# EAGLE board EEG_64 (EAGLE 6.6.0), part 1 of 2
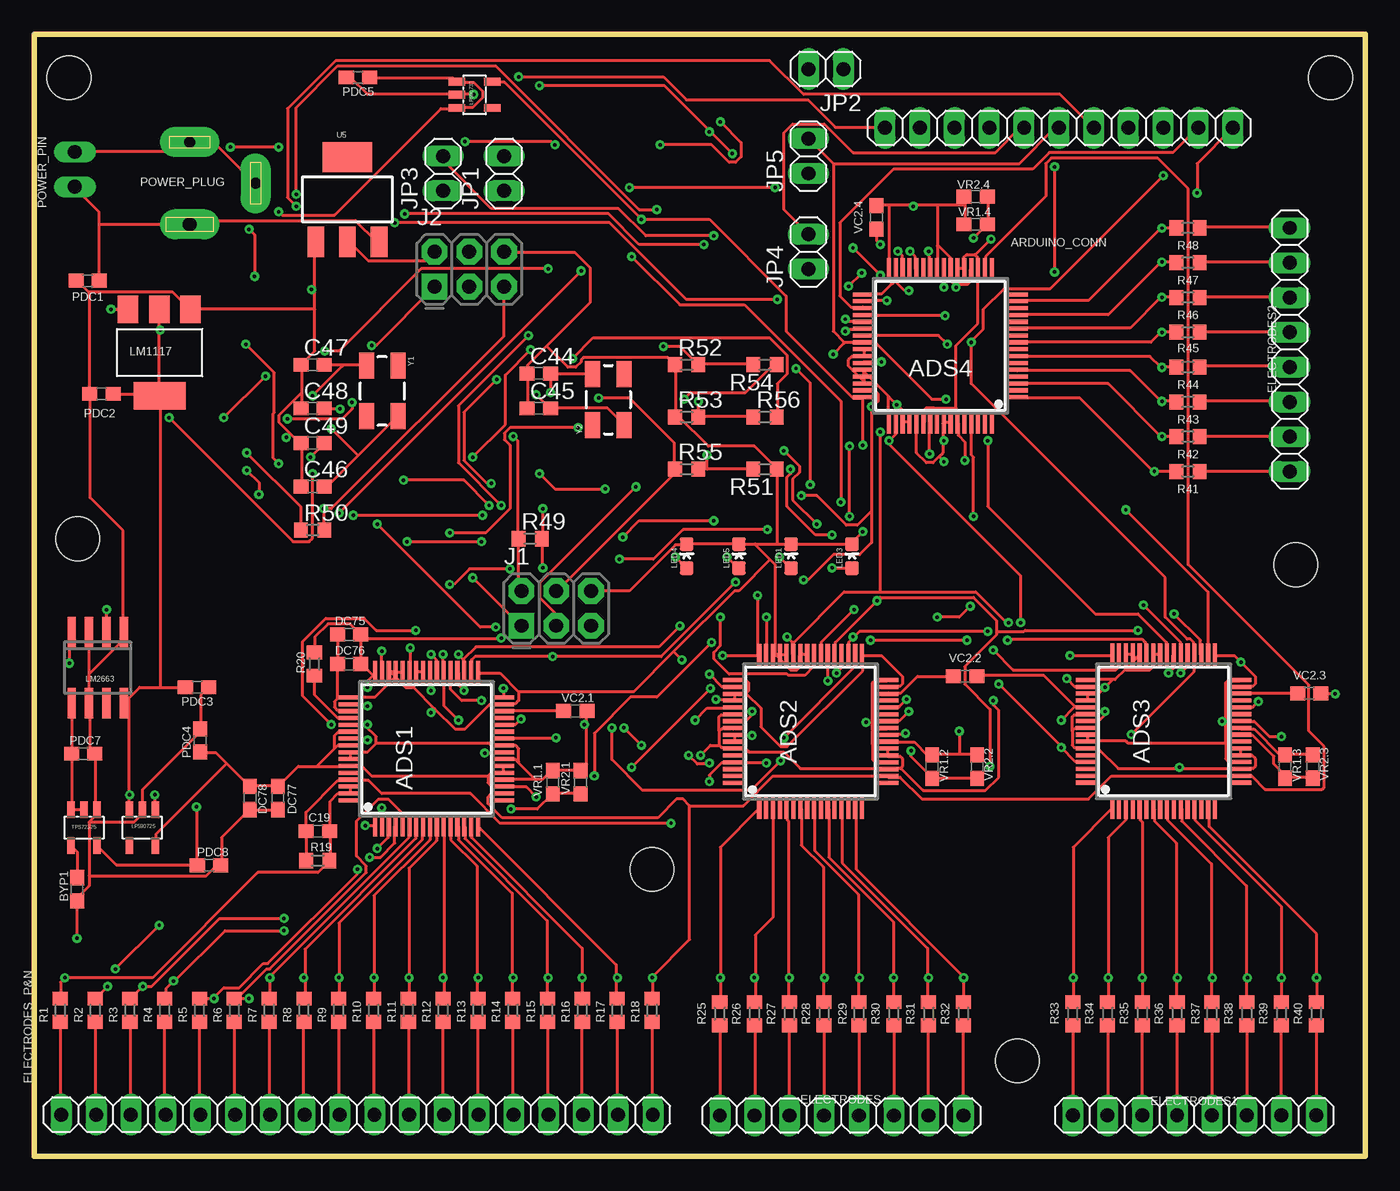
[diagram p3: board, top side]
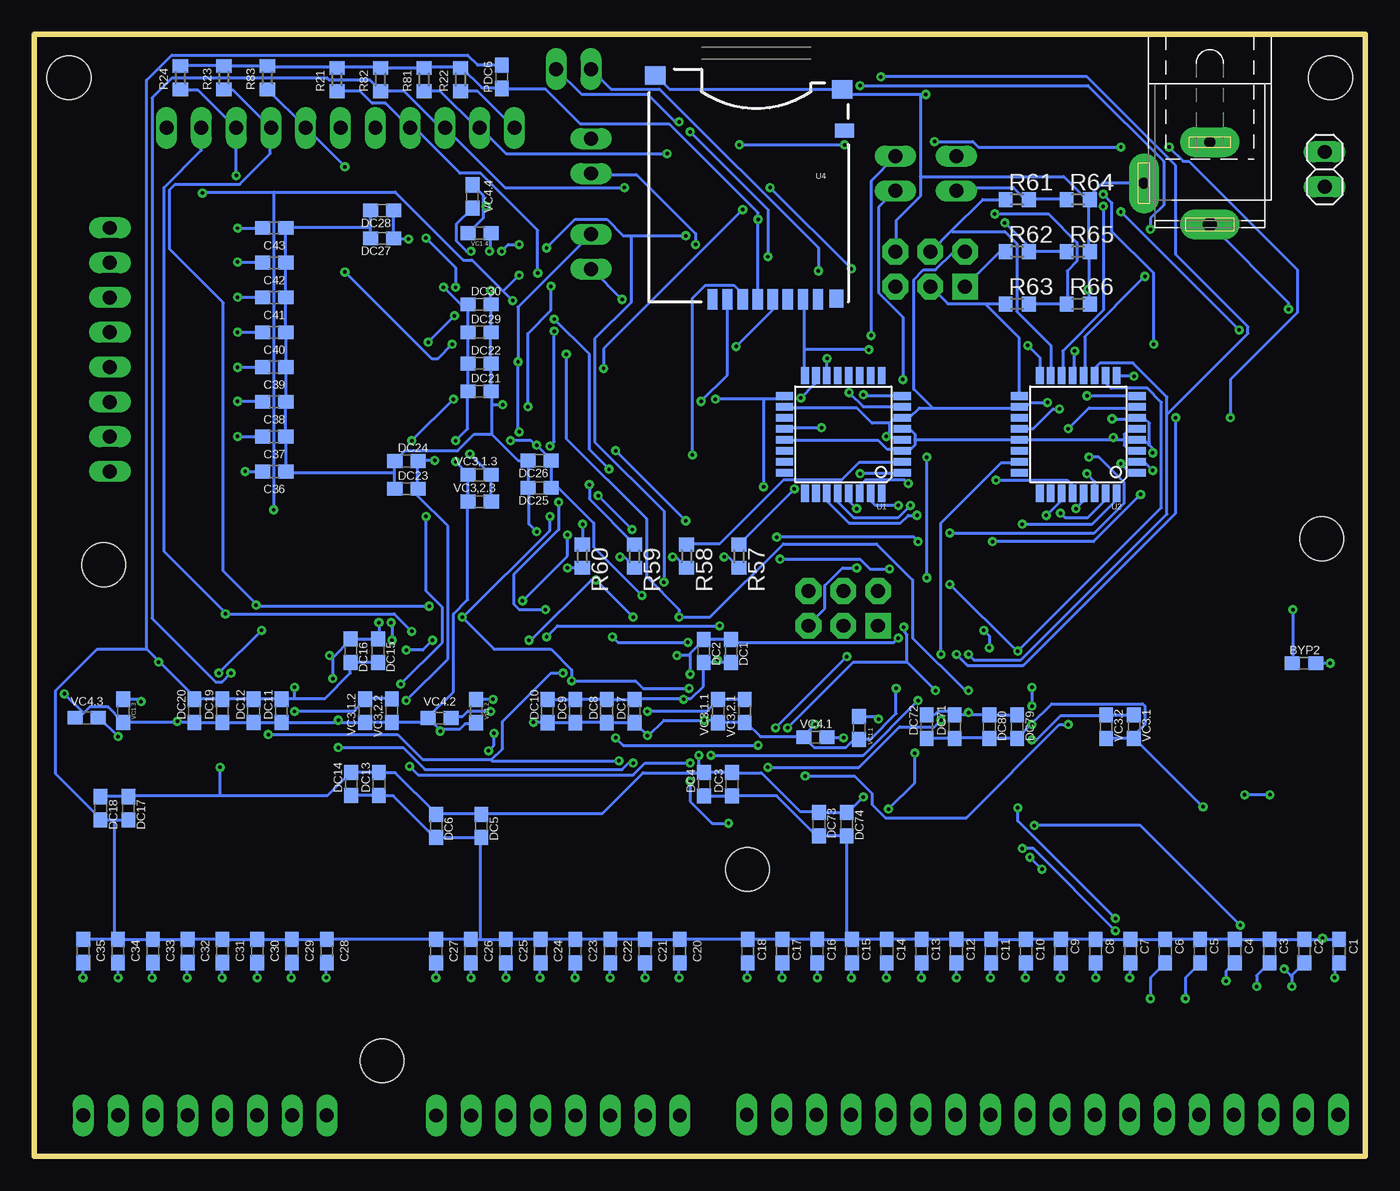
[diagram p4: board, bottom side, seen from below]

Size 97.16 x 81.92 mm. Coordinates in mm from the lower left corner, seen from the top.
Outline: 0,0 0,81.92 97.16,81.92 97.16,0 0,0
Copper layers (1*16): Top 0.035mm / dielectric 1.5mm / Bottom 0.035mm
Design rules "SparkFun *": minimum track width 8mil, minimum drill 10mil, track to track 6mil, track to pad 6mil, pad to pad 6mil, via to via 6mil, smd to smd 6mil, copper to edge 40mil, drill to drill 8mil, minimum pad ring 10mil, minimum via ring 8mil, stop-mask expansion 4mil, vias tented up to drill 30mil, thermal gap 10mil
Holes 3.2 mm at 2.54,78.74 94.61,78.74 71.75,6.99 45.09,20.95 3.17,45.09 92.08,43.18

## Footprints (pad centres in the part's own frame; a part is rotated, then mirrored left to right if it is on the bottom)
PAG_S-PQFP-G64 = smd 1.6 x 0.3: 1 -5.6,3.75; 2 -5.6,3.25; 3 -5.6,2.75; 4 -5.6,2.25; 5 -5.6,1.75; 6 -5.6,1.25; 7 -5.6,0.75; 8 -5.6,0.25; 9 -5.6,-0.25; 10 -5.6,-0.75; 11 -5.6,-1.25; 12 -5.6,-1.75; 13 -5.6,-2.25; 14 -5.6,-2.75; 15 -5.6,-3.25; 16 -5.6,-3.75; 33 5.6,-3.75; 34 5.6,-3.25; 35 5.6,-2.75; 36 5.6,-2.25; 37 5.6,-1.75; 38 5.6,-1.25; 39 5.6,-0.75; 40 5.6,-0.25; 41 5.6,0.25; 42 5.6,0.75; 43 5.6,1.25; 44 5.6,1.75; 45 5.6,2.25; 46 5.6,2.75; 47 5.6,3.25; 48 5.6,3.75 | smd 0.3 x 1.6: 17 -3.75,-5.6; 18 -3.25,-5.6; 19 -2.75,-5.6; 20 -2.25,-5.6; 21 -1.75,-5.6; 22 -1.25,-5.6; 23 -0.75,-5.6; 24 -0.25,-5.6; 25 0.25,-5.6; 26 0.75,-5.6; 27 1.25,-5.6; 28 1.75,-5.6; 29 2.25,-5.6; 30 2.75,-5.6; 31 3.25,-5.6; 32 3.75,-5.6; 49 3.75,5.6; 50 3.25,5.6; 51 2.75,5.6; 52 2.25,5.6; 53 1.75,5.6; 54 1.25,5.6; 55 0.75,5.6; 56 0.25,5.6; 57 -0.25,5.6; 58 -0.75,5.6; 59 -1.25,5.6; 60 -1.75,5.6; 61 -2.25,5.6; 62 -2.75,5.6; 63 -3.25,5.6; 64 -3.75,5.6
1X11 = drill 1.016 long: 1 -12.7,0; 2 -10.16,0; 3 -7.62,0; 4 -5.08,0; 5 -2.54,0; 6 0,0; 7 2.54,0; 8 5.08,0; 9 7.62,0; 10 10.16,0; 11 12.7,0
C0603 = smd 1.1 x 1: 1 -0.85,0; 2 0.85,0
1X08 = drill 1.016 long: 1 -8.89,0; 2 -6.35,0; 3 -3.81,0; 4 -1.27,0; 5 1.27,0; 6 3.81,0; 7 6.35,0; 8 8.89,0
1X18 = drill 1.016 long: 1 -21.59,0; 2 -19.05,0; 3 -16.51,0; 4 -13.97,0; 5 -11.43,0; 6 -8.89,0; 7 -6.35,0; 8 -3.81,0; 9 -1.27,0; 10 1.27,0; 11 3.81,0; 12 6.35,0; 13 8.89,0; 14 11.43,0; 15 13.97,0; 16 16.51,0; 17 19.05,0; 18 21.59,0
2X3-NS = drill 1.016 pad 1.88 square: 1 -2.54,-1.27 | drill 1.016 pad 1.88 octagon: 2 -2.54,1.27; 3 0,-1.27; 4 0,1.27; 5 2.54,-1.27; 6 2.54,1.27
1X02 = drill 1.016 long: 1 -1.27,0; 2 1.27,0
LED-0603 = smd 1 x 1: A 0,-0.877; C 0,0.877
SOT223 = smd 1.499 x 2.007: 1 -2.261,-3.15; 2 0.025,-3.15; 3 2.311,-3.15 | smd 3.81 x 2.007: 4 0,3.15
SO-08 = smd 0.6 x 2.2: 1 -1.905,-2.6; 2 -0.635,-2.6; 3 0.635,-2.6; 4 1.905,-2.6; 5 1.905,2.6; 6 0.635,2.6; 7 -0.635,2.6; 8 -1.905,2.6
SOT23-DBV = smd 0.55 x 1.2: 1 -0.95,-1.3; 2 0,-1.3; 3 0.95,-1.3; 4 0.95,1.3; 5 -0.95,1.3
SPC4077 = drill 0.8 pad 2.184 long: 1 -3,0; 2 0,-4.8 | drill 1 pad 2.184 long: 3 3,0
R0603 = smd 1 x 1.1: 1 -0.85,0; 2 0.85,0
TQFP32-08 = smd 1.27 x 0.559: 1 -4.293,2.8; 2 -4.293,2; 3 -4.293,1.2; 4 -4.293,0.4; 5 -4.293,-0.4; 6 -4.293,-1.2; 7 -4.293,-2; 8 -4.293,-2.8; 17 4.293,-2.8; 18 4.293,-2; 19 4.293,-1.2; 20 4.293,-0.4; 21 4.293,0.4; 22 4.293,1.2; 23 4.293,2; 24 4.293,2.8 | smd 0.559 x 1.27: 9 -2.8,-4.293; 10 -2,-4.293; 11 -1.2,-4.293; 12 -0.4,-4.293; 13 0.4,-4.293; 14 1.2,-4.293; 15 2,-4.293; 16 2.8,-4.293; 25 2.8,4.293; 26 2,4.293; 27 1.2,4.293; 28 0.4,4.293; 29 -0.4,4.293; 30 -1.2,4.293; 31 -2,4.293; 32 -2.8,4.293
USD-SOCKET-PP = smd 0.75 x 1.5: 1 3.2,16.8; 2 2.1,16.8; 3 1,16.8; 4 -0.1,16.8; 5 -1.2,16.8; 6 -2.3,16.8; 7 -3.4,16.8; 8 -4.5,16.8 | smd 1 x 1.3: CD1 -5.85,16.75 | smd 1.4 x 1: CD2 -6.425,4.5 | smd 1.5 x 1.35: GND1 -6.275,1.475; GND2 7.375,0.475
SOT223' = smd 1.219 x 2.235: 1 -2.311,-3.099; 2 0,-3.099; 3 2.311,-3.099 | smd 3.6 x 2.2: 4 0,3.099
CRYSTAL-SMD-5X3 = smd 1.9 x 1.1: 1 -1.85,-1.15; 2 1.85,-1.15; 3 1.85,1.15; 4 -1.85,1.15

## Placement (x,y rotation side)
ADS1  ADS1299  [PAG_S-PQFP-G64]  28.64,29.75 90 top
ADS2  ADS1299  [PAG_S-PQFP-G64]  56.67,31.02 90 top
ADS3  ADS1299  [PAG_S-PQFP-G64]  82.43,31.03 90 top
ADS4  ADS1299  [PAG_S-PQFP-G64]  66.14,59.17 180 top
ARDUINO_CONN  [1X11]  74.8,75.08 0 top
BYP1  0.01uF  [C0603]  3.13,19.5 90 top
BYP2  10uF  [C0603]  4.47,35.99 0 bottom
C1  4.7nF  [C0603]  1.91,14.99 270 bottom
C2  4.7nF  [C0603]  4.45,14.99 270 bottom
C3  4.7nF  [C0603]  6.99,14.99 270 bottom
C4  4.7nF  [C0603]  9.53,14.99 270 bottom
C5  4.7nF  [C0603]  12.06,14.99 270 bottom
C6  4.7nF  [C0603]  14.61,14.99 270 bottom
C7  4.7nF  [C0603]  17.14,14.99 270 bottom
C8  4.7nF  [C0603]  19.68,14.99 270 bottom
C9  4.7nF  [C0603]  22.23,14.99 270 bottom
C10  4.7nF  [C0603]  24.77,14.99 270 bottom
C11  4.7nF  [C0603]  27.3,14.99 270 bottom
C12  4.7nF  [C0603]  29.84,14.99 270 bottom
C13  4.7nF  [C0603]  32.38,14.99 270 bottom
C14  4.7nF  [C0603]  34.92,14.99 270 bottom
C15  4.7nF  [C0603]  37.47,14.99 270 bottom
C16  4.7nF  [C0603]  40.01,14.99 270 bottom
C17  4.7nF  [C0603]  42.55,14.99 270 bottom
C18  4.7nF  [C0603]  45.09,14.99 270 bottom
C19  1.5nF  [C0603]  20.7,23.75 180 top
C20  4.7nF  [C0603]  50.04,14.99 270 bottom
C21  4.7nF  [C0603]  52.58,14.99 270 bottom
C22  4.7nF  [C0603]  55.12,14.99 270 bottom
C23  4.7nF  [C0603]  57.66,14.99 270 bottom
C24  4.7nF  [C0603]  60.2,14.99 270 bottom
C25  4.7nF  [C0603]  62.74,14.99 270 bottom
C26  4.7nF  [C0603]  65.28,14.99 270 bottom
C27  4.7nF  [C0603]  67.82,14.99 270 bottom
C28  4.7nF  [C0603]  75.8,15 270 bottom
C29  4.7nF  [C0603]  78.34,15 270 bottom
C30  4.7nF  [C0603]  80.88,15 270 bottom
C31  4.7nF  [C0603]  83.42,15 270 bottom
C32  4.7nF  [C0603]  85.96,15 270 bottom
C33  4.7nF  [C0603]  88.5,15 270 bottom
C34  4.7nF  [C0603]  91.04,15 270 bottom
C35  4.7nF  [C0603]  93.58,15 270 bottom
C36  4.7nF  [C0603]  79.64,50 180 bottom
C37  4.7nF  [C0603]  79.64,52.54 180 bottom
C38  4.7nF  [C0603]  79.64,55.08 180 bottom
C39  4.7nF  [C0603]  79.64,57.62 180 bottom
C40  4.7nF  [C0603]  79.64,60.16 180 bottom
C41  4.7nF  [C0603]  79.64,62.7 180 bottom
C42  4.7nF  [C0603]  79.64,65.24 180 bottom
C43  4.7nF  [C0603]  79.64,67.78 180 bottom
C44  4.7nF  [C0603]  36.83,57.15 0 top
C45  4.7nF  [C0603]  36.83,54.61 0 top
C46  4.7nF  [C0603]  20.32,48.9 0 top
C47  4.7nF  [C0603]  20.32,57.78 0 top
C48  4.7nF  [C0603]  20.32,54.61 0 top
C49  4.7nF  [C0603]  20.32,52.07 0 top
DC1  1uF  [C0603]  46.3,36.89 270 bottom
DC2  0.1uF  [C0603]  48.3,36.89 270 bottom
DC3  1uF  [C0603]  46.23,27.18 270 bottom
DC4  0.1uF  [C0603]  48.26,27.18 270 bottom
DC5  1uF  [C0603]  64.52,24.13 270 bottom
DC6  0.1uF  [C0603]  67.82,24.13 270 bottom
DC7  1uF  [C0603]  53.34,32.51 90 bottom
DC8  0.1uF  [C0603]  55.37,32.51 90 bottom
DC9  1uF  [C0603]  57.66,32.51 90 bottom
DC10  0.1uF  [C0603]  59.69,32.51 90 bottom
DC11  1uF  [C0603]  79.1,32.52 90 bottom
DC12  0.1uF  [C0603]  81.14,32.52 90 bottom
DC13  1uF  [C0603]  71.99,27.19 270 bottom
DC14  0.1uF  [C0603]  74.02,27.19 270 bottom
DC15  1uF  [C0603]  72.06,36.91 270 bottom
DC16  0.1uF  [C0603]  74.06,36.91 270 bottom
DC17  1uF  [C0603]  90.28,25.41 270 bottom
DC18  0.1uF  [C0603]  92.31,25.41 270 bottom
DC19  1uF  [C0603]  83.42,32.52 90 bottom
DC20  0.1uF  [C0603]  85.45,32.52 90 bottom
DC21  1uF  [C0603]  64.65,55.84 0 bottom
DC22  0.1uF  [C0603]  64.65,57.87 0 bottom
DC23  1uF  [C0603]  69.98,48.73 180 bottom
DC24  0.1uF  [C0603]  69.98,50.76 180 bottom
DC25  1uF  [C0603]  60.27,48.8 180 bottom
DC26  0.1uF  [C0603]  60.27,50.8 180 bottom
DC27  1uF  [C0603]  71.76,67.02 180 bottom
DC28  0.1uF  [C0603]  71.76,69.05 180 bottom
DC29  1uF  [C0603]  64.65,60.16 0 bottom
DC30  0.1uF  [C0603]  64.65,62.19 0 bottom
DC71  1uF  [C0603]  29.97,31.37 90 bottom
DC72  0.1uF  [C0603]  32,31.37 90 bottom
DC73  1uF  [C0603]  39.88,24.26 270 bottom
DC74  0.1uF  [C0603]  37.85,24.26 270 bottom
DC75  1uF  [C0603]  22.99,38.1 180 top
DC76  0.1uF  [C0603]  22.99,35.94 180 top
DC77  1uF  [C0603]  17.78,26.16 270 top
DC78  0.1uF  [C0603]  15.75,26.16 270 top
DC79  1uF  [C0603]  25.4,31.37 90 bottom
DC80  0.1uF  [C0603]  27.43,31.37 90 bottom
ELECTRODES  [1X08]  58.93,2.98 180 top
ELECTRODES1  [1X08]  84.69,3 180 top
ELECTRODES2  [1X08]  91.64,58.89 270 top
ELECTRODES_P&N  [1X18]  23.56,3.05 180 top
J1  AVR_SPI_PRG_6NS  [2X3-NS]  38.1,40.01 0 top
J2  AVR_SPI_PRG_6NS  [2X3-NS]  31.75,64.77 0 top
JP1  [1X02]  34.29,71.75 90 top
JP2  [1X02]  57.78,79.38 180 top
JP3  [1X02]  29.84,71.75 90 top
JP4  [1X02]  56.52,66.04 90 top
JP5  [1X02]  56.52,73.03 90 top
LED1  [LED-0603]  55.24,43.81 0 top
LED3  [LED-0603]  59.69,43.81 0 top
LED4  [LED-0603]  47.62,43.81 0 top
LED5  [LED-0603]  51.44,43.81 0 top
LM1117  LM1117  [SOT223]  9.15,58.67 180 top
LM2663  LM2663  [SO-08]  4.64,35.69 180 top
LP590725  LP590725  [SOT23-DBV]  7.88,24 180 top
LP590733  LP590733  [SOT23-DBV]  32.13,77.5 270 top
PDC1  10uF  [C0603]  3.9,63.92 180 top
PDC2  10uF  [C0603]  4.9,55.67 180 top
PDC3  1uF  [C0603]  11.88,34.25 180 top
PDC4  1uF  [C0603]  12.11,30.36 270 top
PDC5  1uF  [C0603]  23.64,78.77 180 top
PDC6  1uF  [C0603]  63.03,78.81 270 bottom
PDC7  2.2uF  [C0603]  3.58,29.39 0 top
PDC8  2.2uF  [C0603]  12.76,21.25 0 top
POWER_PIN  [1X02]  2.96,72.06 90 bottom
POWER_PLUG  [SPC4077]  11.35,71.04 270 bottom
R1  5K  [R0603]  1.91,10.67 90 top
R2  5K  [R0603]  4.45,10.67 90 top
R3  5K  [R0603]  6.99,10.67 90 top
R4  5K  [R0603]  9.53,10.67 90 top
R5  5K  [R0603]  12.06,10.67 90 top
R6  5K  [R0603]  14.61,10.67 90 top
R7  5K  [R0603]  17.14,10.67 90 top
R8  5K  [R0603]  19.68,10.67 90 top
R9  5K  [R0603]  22.23,10.67 90 top
R10  5K  [R0603]  24.77,10.67 90 top
R11  5K  [R0603]  27.3,10.67 90 top
R12  5K  [R0603]  29.84,10.67 90 top
R13  5K  [R0603]  32.38,10.67 90 top
R14  5K  [R0603]  34.92,10.67 90 top
R15  5K  [R0603]  37.47,10.67 90 top
R16  5K  [R0603]  40.01,10.67 90 top
R17  5K  [R0603]  42.55,10.67 90 top
R18  5K  [R0603]  45.09,10.67 90 top
R19  1M  [R0603]  20.7,21.59 180 top
R20  10K  [R0603]  20.45,35.94 270 top
R21  10K  [R0603]  75.06,78.61 90 bottom
R22  10K  [R0603]  66.04,78.61 90 bottom
R23  10K  [R0603]  83.31,78.74 90 bottom
R24  10K  [R0603]  86.49,78.74 90 bottom
R25  5K  [R0603]  50.04,10.41 90 top
R26  5K  [R0603]  52.58,10.41 90 top
R27  5K  [R0603]  55.12,10.41 90 top
R28  5K  [R0603]  57.66,10.41 90 top
R29  5K  [R0603]  60.2,10.41 90 top
R30  5K  [R0603]  62.74,10.41 90 top
R31  5K  [R0603]  65.28,10.41 90 top
R32  5K  [R0603]  67.82,10.41 90 top
R33  5K  [R0603]  75.8,10.43 90 top
R34  5K  [R0603]  78.34,10.43 90 top
R35  5K  [R0603]  80.88,10.43 90 top
R36  5K  [R0603]  83.42,10.43 90 top
R37  5K  [R0603]  85.96,10.43 90 top
R38  5K  [R0603]  88.5,10.43 90 top
R39  5K  [R0603]  91.04,10.43 90 top
R40  5K  [R0603]  93.58,10.43 90 top
R41  5K  [R0603]  84.21,50 180 top
R42  5K  [R0603]  84.21,52.54 180 top
R43  5K  [R0603]  84.21,55.08 180 top
R44  5K  [R0603]  84.21,57.62 180 top
R45  5K  [R0603]  84.21,60.16 180 top
R46  5K  [R0603]  84.21,62.7 180 top
R47  5K  [R0603]  84.21,65.24 180 top
R48  5K  [R0603]  84.21,67.78 180 top
R49  5K  [R0603]  36.2,45.09 0 top
R50  5K  [R0603]  20.32,45.72 0 top
R51  5K  [R0603]  53.34,50.16 180 top
R52  5K  [R0603]  47.62,57.78 0 top
R53  5K  [R0603]  47.62,53.98 0 top
R54  5K  [R0603]  53.34,57.78 180 top
R55  5K  [R0603]  47.62,50.16 0 top
R56  5K  [R0603]  53.34,53.98 0 top
R57  5K  [R0603]  45.72,43.81 270 bottom
R58  5K  [R0603]  49.53,43.81 270 bottom
R59  5K  [R0603]  53.34,43.81 270 bottom
R60  5K  [R0603]  57.15,43.81 270 bottom
R61  5K  [R0603]  25.4,69.85 0 bottom
R62  5K  [R0603]  25.4,66.04 0 bottom
R63  5K  [R0603]  25.4,62.23 0 bottom
R64  5K  [R0603]  20.95,69.85 0 bottom
R65  5K  [R0603]  20.95,66.04 0 bottom
R66  5K  [R0603]  20.95,62.23 0 bottom
R81  [R0603]  68.71,78.61 90 bottom
R82  [R0603]  71.88,78.61 90 bottom
R83  [R0603]  80.14,78.74 90 bottom
TPS72325  TPS723XX25  [SOT23-DBV]  3.63,24 180 top
U1  ATMEGA328P  [TQFP32-08]  38.1,52.7 180 bottom
U2  ATMEGA328P  [TQFP32-08]  20.95,52.7 180 bottom
U4  USD-SOCKETUSD  [USD-SOCKET-PP]  44.45,79.38 180 bottom
U5  V_REG_317SMD  [SOT223']  22.86,69.85 0 top
VC1.1  100uF  [C0603]  36.95,31.27 270 bottom
VC1.2  100uF  [C0603]  64.9,32.51 270 bottom
VC1.3  100uF  [C0603]  90.66,32.52 270 bottom
VC1.4  100uF  [C0603]  64.65,67.4 180 bottom
VC2.1  1uF  [C0603]  39.5,32.51 0 top
VC2.2  1uF  [C0603]  67.95,35.05 0 top
VC2.3  1uF  [C0603]  93.07,33.79 0 top
VC2.4  1uF  [C0603]  61.48,68.54 90 top
VC3,1.1  1uF  [C0603]  47.24,32.51 270 bottom
VC3,1.2  1uF  [C0603]  73.01,32.52 270 bottom
VC3,1.3  1uF  [C0603]  64.65,49.74 180 bottom
VC3,2.1  0.1uF  [C0603]  45.3,32.52 270 bottom
VC3,2.2  0.1uF  [C0603]  71.06,32.53 270 bottom
VC3,2.3  0.1uF  [C0603]  64.64,47.8 180 bottom
VC3.1  1uF  [C0603]  16.89,31.37 270 bottom
VC3.2  0.1uF  [C0603]  18.92,31.37 270 bottom
VC4.1  1uF  [C0603]  40.13,30.61 180 bottom
VC4.2  1uF  [C0603]  67.56,32 180 bottom
VC4.3  1uF  [C0603]  93.33,32.02 180 bottom
VC4.4  1uF  [C0603]  65.16,70.06 90 bottom
VR1.1  0.1uF  [C0603]  37.85,27.3 90 top
VR1.2  0.1uF  [C0603]  65.53,28.45 90 top
VR1.3  0.1uF  [C0603]  91.3,28.46 90 top
VR1.4  0.1uF  [C0603]  68.72,68.03 180 top
VR2.1  10uF  [C0603]  39.88,27.3 90 top
VR2.2  10uF  [C0603]  68.83,28.45 90 top
VR2.3  10uF  [C0603]  93.33,28.46 90 top
VR2.4  10uF  [C0603]  68.72,70.06 180 top
Y1  [CRYSTAL-SMD-5X3]  25.4,55.88 270 top
Y2  [CRYSTAL-SMD-5X3]  41.91,55.24 90 top